# Altium schematic sheet S1-MAIN-20201205.SchDoc
size A2
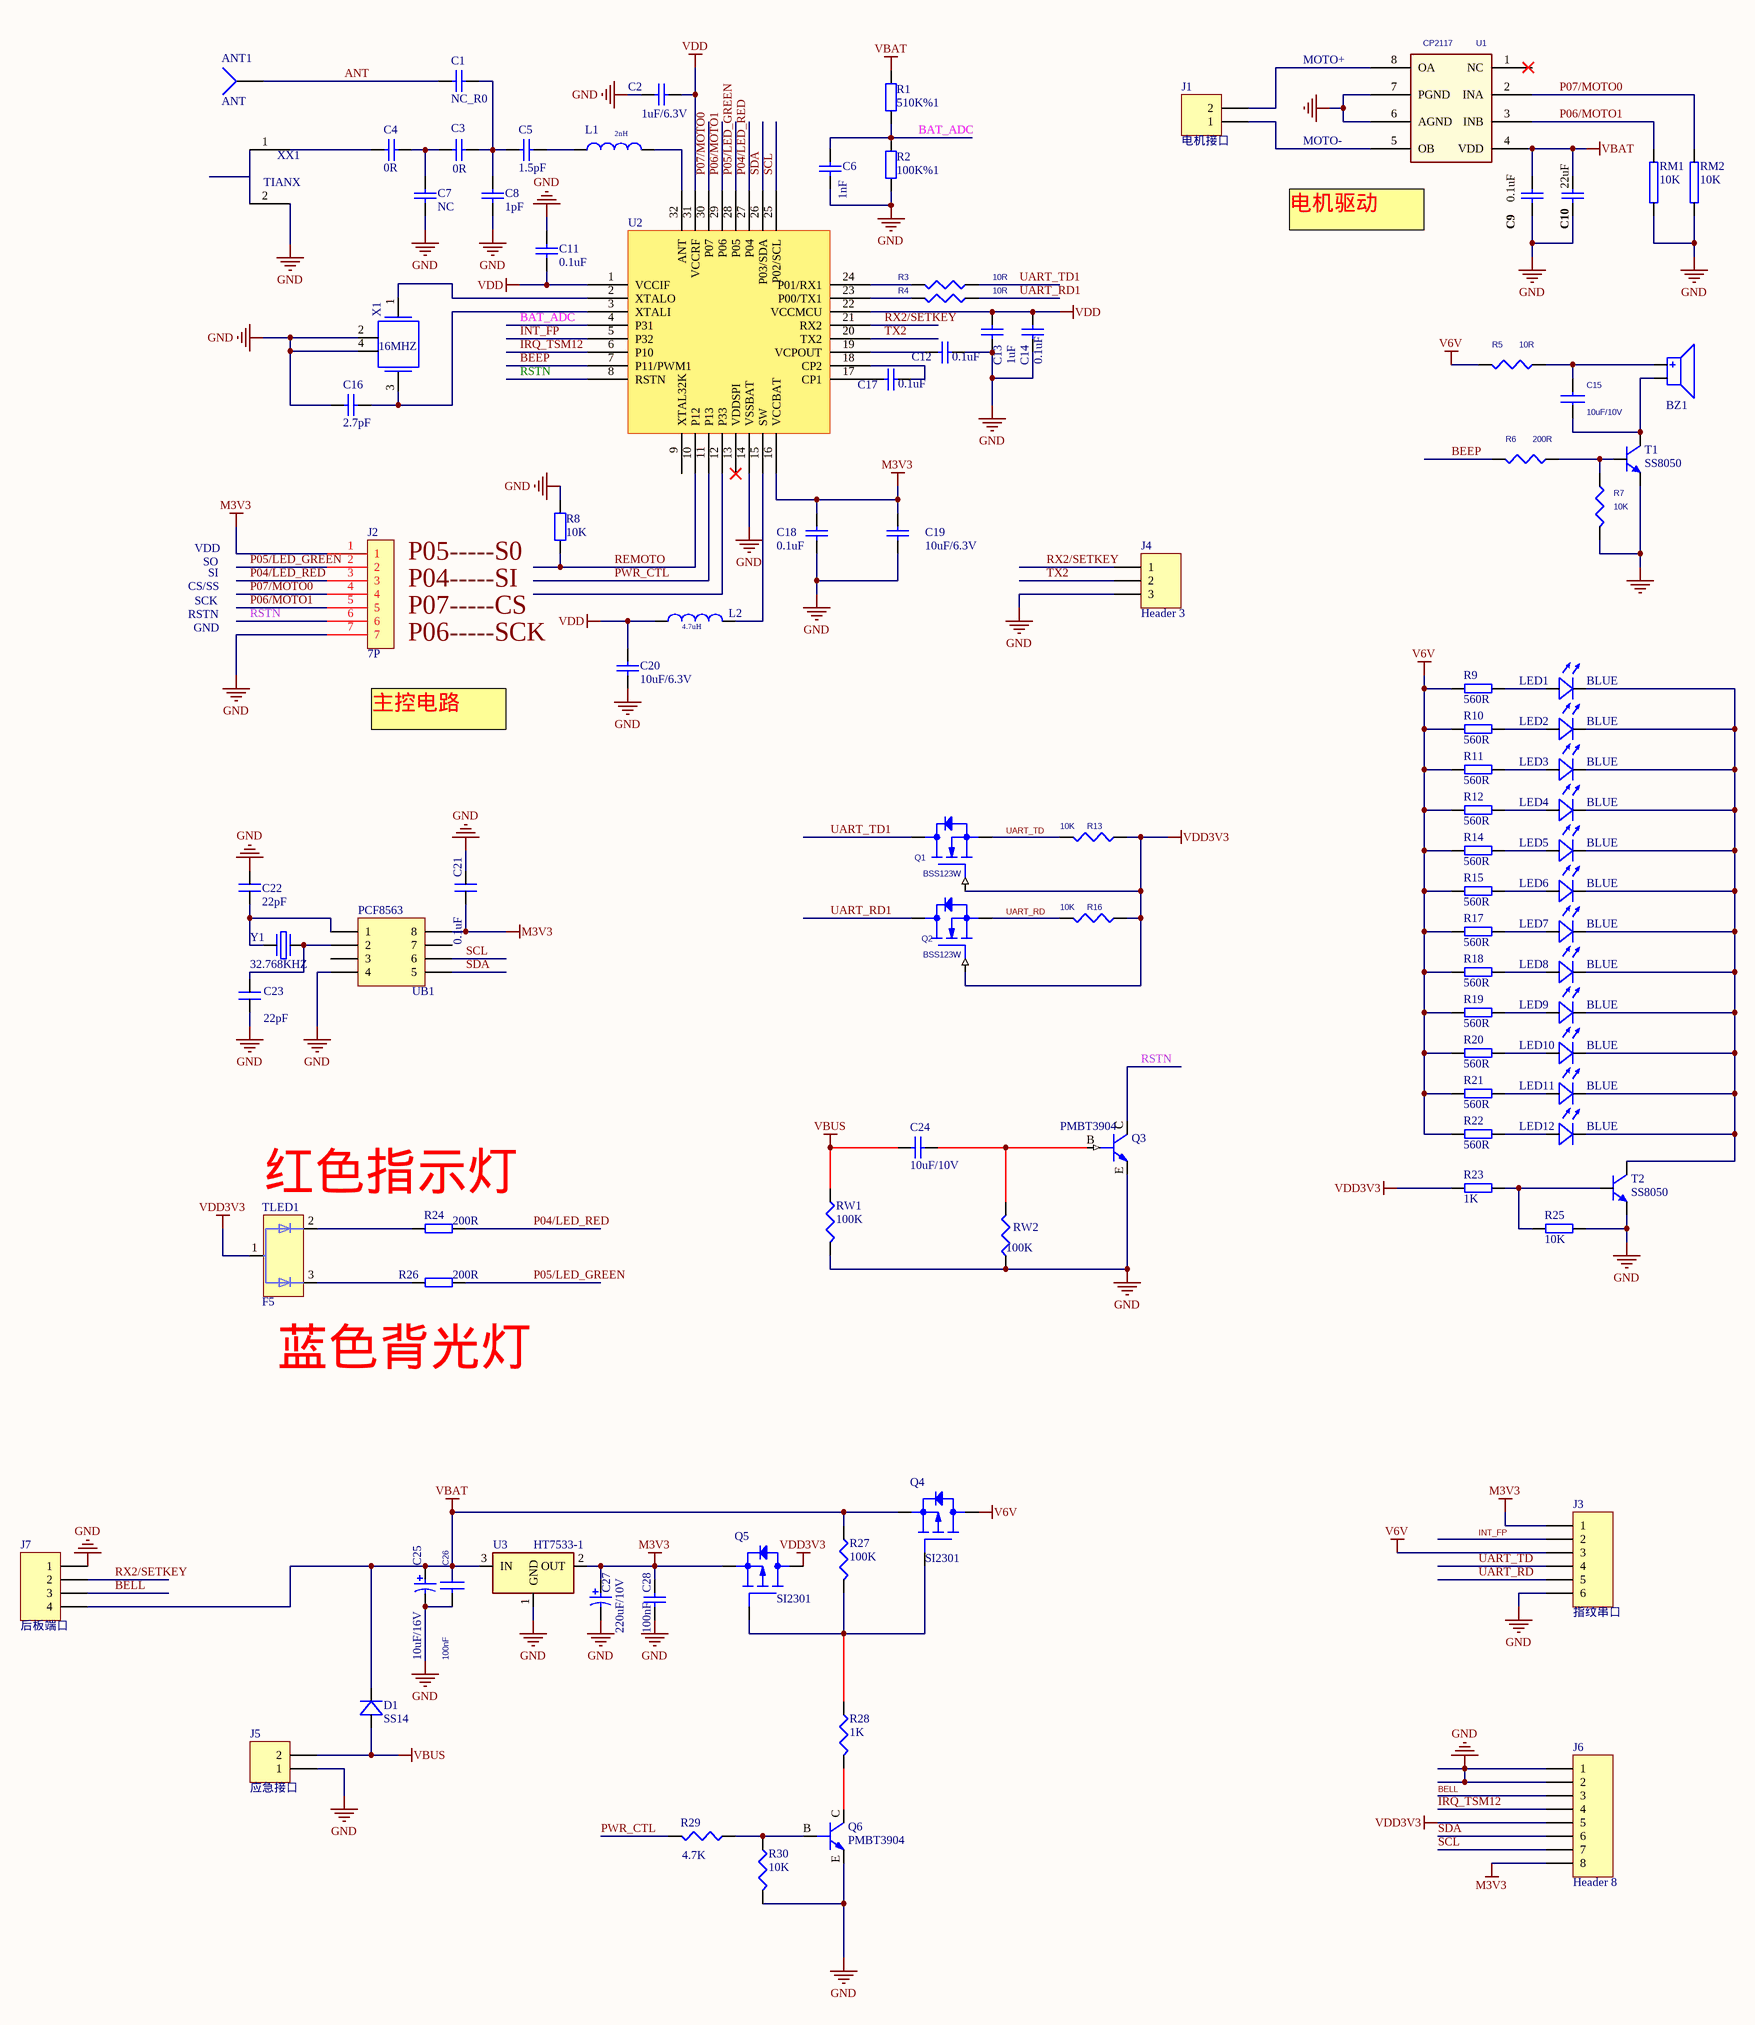
[diagram p0: S1-MAIN-20201205.SchDoc]

## Parts
ANT1  ANT  [ANT]
BZ1  BUZZER  [BUZZER_D93_L40]  (value not drawn)
C1  NC_R0  [0603C]
C2  1uF/6.3V  [0603C]
C3  0R  [0603C]
C4  0R  [0603C]
C5  1.5pF  [0603C]
C6  1nF  [0603C]
C7  NC  [0603C]
C8  1pF  [0603C]
C9  0.1uF  [0603C]
C10  22uF  [0805C]
C11  0.1uF  [0603C]
C12  0.1uF  [0603C]
C13  1uF  [0603C]
C14  0.1uF  [0603C]
C15  10uF/10V  [0603C]
C16  2.7pF  [0603C]
C17  0.1uF  [0603C]
C18  0.1uF  [0603C]
C19  10uF/6.3V  [0603C]
C20  10uF/6.3V  [0603C]
C21  0.1uF  [0603C]
C22  22pF  [0603C]
C23  22pF  [0603C]
C24  10uF/10V  [0603C]
C25  10uF/16V  [0805C]
C26  100nF  [0603C]
C27  220uF/10V  [CAP-SMD_6.3*5.8]
C28  100nF  [0603C]
D1  SS14  [LC-SMAF_S1]
J1  电机接口  [S2B-PH-SM3-TB]
J2  7P  [7P-2.0MM]
J3  指纹串口  [6P-0.5MM_1]
J4  Header 3  [3P-2.54MM]
J5  应急接口  [2P-1.25mm]
J6  Header 8  [8P-1.25MM]
J7  后板端口  [JC20-4P]
L1  2nH  [0603L]
L2  4.7uH  [0805L]
LED1  BLUE  [0603LED]
LED2  BLUE  [0603LED]
LED3  BLUE  [0603LED]
LED4  BLUE  [0603LED]
LED5  BLUE  [0603LED]
LED6  BLUE  [0603LED]
LED7  BLUE  [0603LED]
LED8  BLUE  [0603LED]
LED9  BLUE  [0603LED]
LED10  BLUE  [0603LED]
LED11  BLUE  [0603LED]
LED12  BLUE  [0603LED]
Q1  BSS123W  [SOT-23 - GDS]
Q2  BSS123W  [SOT-23 - GDS]
Q3  PMBT3904  [SOT-23 - BCE]
Q4  SI2301  [SOT-23 - GDS]
Q5  SI2301  [SOT-23 - GDS]
Q6  PMBT3904  [SOT-23 - BCE]
R1  510K%1  [0603R]
R2  100K%1  [0603R]
R3  10R  [0603R]
R4  10R  [0603R]
R5  10R  [0603R]
R6  200R  [0603R]
R7  10K  [0603R]
R8  10K  [0603R]
R9  560R  [0603R]
R10  560R  [0603R]
R11  560R  [0603R]
R12  560R  [0603R]
R13  10K  [0603R]
R14  560R  [0603R]
R15  560R  [0603R]
R16  10K  [0603R]
R17  560R  [0603R]
R18  560R  [0603R]
R19  560R  [0603R]
R20  560R  [0603R]
R21  560R  [0603R]
R22  560R  [0603R]
R23  1K  [0603R]
R24  200R  [LC-0603_R]
R25  10K  [0603R]
R26  200R  [LC-0603_R]
R27  100K  [LC-0603_R]
R28  1K  [LC-0603_R]
R29  4.7K  [LC-0603_R]
R30  10K  [LC-0603_R]
RM1  10K  [0603R]
RM2  10K  [0603R]
RW1  100K  [LC-0603_R]
RW2  100K  [LC-0603_R]
T1  SS8050  [SOT-23-3L]
T2  SS8050  [SOT-23-3L]
TLED1  F5  [F5_DIP2]
U1  CP2117  [SOP8]
U2  BK3431Q  [QFN32_4*4*0.4]  (value not drawn)
U3  HT7533-1  [SOT-23-3L]
UB1  PCF8563  [SOP8]
X1  16MHZ  [XTAL3225]
XX1  TIANX  [BT_NAMI]
Y1  32.768KHZ  [晶振-9]

## Nets
GND: C2.1 C6.1 C7.2 C8.1 C9.2 C10.2 C11.1 C12.2 C13.1 C14.1 C16.1 C18.2 C19.2 C20.1 C21.2 C22.2 C23.1 C25.2 C26.2 C27.2 C28.2 J2.7 J3.6 J4.3 J5.1 J6.1 J6.2 J7.1 Q3.E(EMITTER) Q6.E(EMITTER) R2.2 R7.2 R8.1 R25.1 R30.2 RM1.1 RM2.1 RW1.2 RW2.1 T1.2 T2.2 U1.6(AGND) U1.7(PGND) U2.14(VSSBAT) U3.1(GND) UB1.4 X1.2 X1.4 XX1.2
M3V3: C18.1 C19.1 C21.1 C27.1 C28.1 J2.1 J3.1 J6.8 Q5.S(SOURCE) U2.16(VCCBAT) U3.2(OUT) UB1.8
V6V: J3.3 Q4.D(DRAIN) R5.2 R9.1 R10.1 R11.1 R12.1 R14.1 R15.1 R17.1 R18.1 R19.1 R20.1 R21.1 R22.1
VBAT: C9.1 C10.1 C25.1 C26.1 D1.2(K) J7.4 Q4.S(SOURCE) R1.1 R27.1 U1.4(VDD) U3.3(IN)
VBUS: C24.1 D1.1(A) J5.2 RW1.1
VDD: C2.2 C11.2 C13.2 C14.2 C20.2 L2.1(P1) U2.1(VCCIF) U2.22(VCCMCU) U2.31(VCCRF)
VDD3V3: J6.5 Q1.G(GATE) Q2.G(GATE) Q5.D(DRAIN) R13.2 R16.2 R23.1 TLED1.1(A)
ANT: ANT1.1 C1.1
BAT_ADC: C6.2 R1.2 R2.1 U2.4(P31)
BEEP: R6.2 U2.7(P11/PWM1)
BELL: J6.3 J7.3
INT_FP: J3.2 U2.5(P32)
IRQ_TSM12: J6.4 U2.6(P10)
P04/LED_RED: J2.3 R24.2 U2.27(P04)
P05/LED_GREEN: J2.2 R26.2 U2.28(P05)
P06/MOTO1: J2.5 RM1.2 U1.3(INB) U2.29(P06)
P07/MOTO0: J2.4 RM2.2 U1.2(INA) U2.30(P07)
PWR_CTL: R29.2 U2.11(P13)
REMOTO: R8.2 U2.10(P12)
RSTN: J2.6 Q3.C(COLLECTOR) U2.8(RSTN)
RX2/SETKEY: J4.1 J7.2 U2.21(RX2)
SCL: J6.7 U2.25(P02/SCL) UB1.6
SDA: J6.6 U2.26(P03/SDA) UB1.5
TX2: J4.2 U2.20(TX2)
UART_RD: J3.5 Q2.S(SOURCE) R16.1
UART_RD1: Q2.D(DRAIN) R4.1
UART_TD: J3.4 Q1.S(SOURCE) R13.1
UART_TD1: Q1.D(DRAIN) R3.1
NetBZ1_1: BZ1.1 C15.2 R5.1
NetBZ1_2: BZ1.2 C15.1 T1.3
NetC1_2: C1.2 C3.2 C5.2 C8.2
NetC3_1: C3.1 C4.2 C7.1
NetC4_1: C4.1 XX1.1
NetC5_1: C5.1 L1.1(P1)
NetC12_1: C12.1 U2.19(VCPOUT)
NetC16_2: C16.2 U2.3(XTALI) X1.3
NetC17_1: C17.1 U2.17(CP1)
NetC17_2: C17.2 U2.18(CP2)
NetC22_1: C22.1 UB1.1 Y1.2
NetC23_2: C23.2 UB1.2 Y1.1
NetC24_2: C24.2 Q3.B(BASE) RW2.2
NetJ1_1: J1.1 U1.5(OB)
NetJ1_2: J1.2 U1.8(OA)
NetL1_2: L1.2(P2) U2.32(ANT)
NetL2_2: L2.2(P2) U2.15(SW)
NetLED1_1: LED1.1(A) R9.2
NetLED1_2: LED1.2(K) LED2.2(K) LED3.2(K) LED4.2(K) LED5.2(K) LED6.2(K) LED7.2(K) LED8.2(K) LED9.2(K) LED10.2(K) LED11.2(K) LED12.2(K) T2.3
NetLED2_1: LED2.1(A) R10.2
NetLED3_1: LED3.1(A) R11.2
NetLED4_1: LED4.1(A) R12.2
NetLED5_1: LED5.1(A) R14.2
NetLED6_1: LED6.1(A) R15.2
NetLED7_1: LED7.1(A) R17.2
NetLED8_1: LED8.1(A) R18.2
NetLED9_1: LED9.1(A) R19.2
NetLED10_1: LED10.1(A) R20.2
NetLED11_1: LED11.1(A) R21.2
NetLED12_1: LED12.1(A) R22.2
NetQ4_G: Q4.G(GATE) Q5.G(GATE) R27.2 R28.1
NetQ6_B: Q6.B(BASE) R29.1 R30.1
NetQ6_C: Q6.C(COLLECTOR) R28.2
NetR3_2: R3.2 U2.24(P01/RX1)
NetR4_2: R4.2 U2.23(P00/TX1)
NetR6_1: R6.1 R7.1 T1.1
NetR23_2: R23.2 R25.2 T2.1
NetR24_1: R24.1 TLED1.2(RK)
NetR26_1: R26.1 TLED1.3(GK)
NetU2_2: U2.2(XTALO) X1.1

Not connected (* = marked no-connect by the designer): U1 1(NC); U2 9(XTAL32K) 12(P33) 13(VDDSPI)*; UB1 3 7

## Notes on the sheet
- MOTO+
- MOTO-
- (near U1) 电机驱动
- CS/SS
- SCK
- VDD
- SO
- SI
- P04-----SI
- (near R8) P05-----S0
- RSTN
- GND
- (near J2) P06-----SCK
- P07-----CS
- 主控电路
- 红色指示灯
- 蓝色背光灯

## Library data of the parts
ANT1 = Socket: LatestRevisionDate: 17-Jul-2002; LatestRevisionNote: Re-released for DXP Platform.; Publisher: Altium Limited
C1-C5 C7 C8 C11-C14 C16-C20 = Cap: Capacitor; Value: 10pF; Published: 8-Jun-2000; LatestRevisionDate: 17-Jul-2002; LatestRevisionNote: Re-released for DXP Platform.; PackageReference: RAD-0.3; Publisher: Altium Limited; PackageDescription: Radial Cap, Thru-Hole; 2 Leads; 0.3 in Pin Spacing
C6 C9 C10 C24 C28 = CAP-NP: Capacitor, Ceramic; Capacitance: 18 pF; Dielectric: COG; Polarity: Non-Polarized; Rated Voltage: 50 mV; Tolerance: 5 %; Category: Capacitor; Mounting Technology: Surface Mount; Status: Unreleased; Technology: Ceramic
C15 = C_0_Dup1
C21-C23 = C
C25 C27 = CAP-P: Capacitor, tolerance ±20%
C26 = CAP NP
D1 = D
J1 = MHDR1X2: Header, 2-Pin; LatestRevisionDate: 17-Jul-2002; LatestRevisionNote: Re-released for DXP Platform.; Publisher: Altium Limited
J3 = Header 6: Header, 6-Pin; LatestRevisionDate: 17-Jul-2002; LatestRevisionNote: Re-released for DXP Platform.; Publisher: Altium Limited
J4 = Header 3: Header, 3-Pin; LatestRevisionDate: 17-Jul-2002; LatestRevisionNote: Re-released for DXP Platform.; Publisher: Altium Limited
J5 = Header 2: Header, 2-Pin; LatestRevisionDate: 17-Jul-2002; LatestRevisionNote: Re-released for DXP Platform.; Publisher: Altium Limited
J6 = Header 8: Header, 8-Pin; LatestRevisionDate: 17-Jul-2002; LatestRevisionNote: Re-released for DXP Platform.; Publisher: Altium Limited
J7 = Header 4H: Header, 4-Pin, Right Angle; LatestRevisionDate: 17-Jul-2002; LatestRevisionNote: Re-released for DXP Platform.; Publisher: Altium Limited
L1 L2 = INDUCTOR: Power Inductor, 4.7uH, 0.7A, 260mR DCR; XMOS Part Number: E-09-0011; Manufacturer: Taiyo Yuden; Manufacturer Part Number: CBC2518T4R7M; Part Creator: JG; LEVEL: STD; DEVICE: L; FORWARD_PCB: 1; Tolerance (%): 20; Max DC Resistance: 0.26R; Rated Current (Saturation): 0.68A; Rated Current (Temp Rise): 0.92A; Approx Volume Cost ($): 0.07; Approved: NO; VALUE: 2.0nH; Datasheet: http://www.yuden.co.jp/us/product/pdf/ecb2_e.pdf; Max Height (mm): 2; Digikey Link: http://search.digikey.com/scripts/DkSearch/dksus.dll?lang=en&site=US&keywords=CBC2518T4R7M
LED1-LED12 = LED
Q1 Q2 = BSS123L_0
Q4 Q5 = PWRMOSFET_EP_DGS_0
R1 R2 R8 = Res2: Resistor; Value: 470K; Published: 2013年12月24日; LatestRevisionDate: 2013年12月24日; LatestRevisionNote: Re-released for DXP Platform.
R3-R7 = R_Dup1
R9-R12 R14 R15 R17-R30 RW1 RW2 = R
R13 R16 = RES
RM1 RM2 = Pro71C3.TMP_UnNamed_1
T1 T2 = NPN_BJT: Bipolar Junction Transistor
TLED1 = WWXMFGLY
U1 = AM24LC02_0
U3 = XC6206P302M
UB1 = IC8
X1 = OSC: XMOS Part Number: E-07-0030; Manufacturer: Abracon; Manufacturer Part Number: ABLS-24.000MHz-B4; Part Creator: JG; LEVEL: STD; DEVICE: X; FORWARD_PCB: 1; Approx Volume Cost ($): 0.15; Approved: NO; VALUE: ABLS; FREQUENCY: 38.4MHZ; Datasheet: http://www.abracon.com/Resonators/abls.pdf; Max Height (mm): 4.2; Supplier Link: http://search.digikey.com/scripts/DkSearch/dksus.dll?lang=en&site=US&keywords=ABLS-24.000MHz-B4
Y1 = 晶振